# Altium schematic sheet ADC.SchDoc
size A
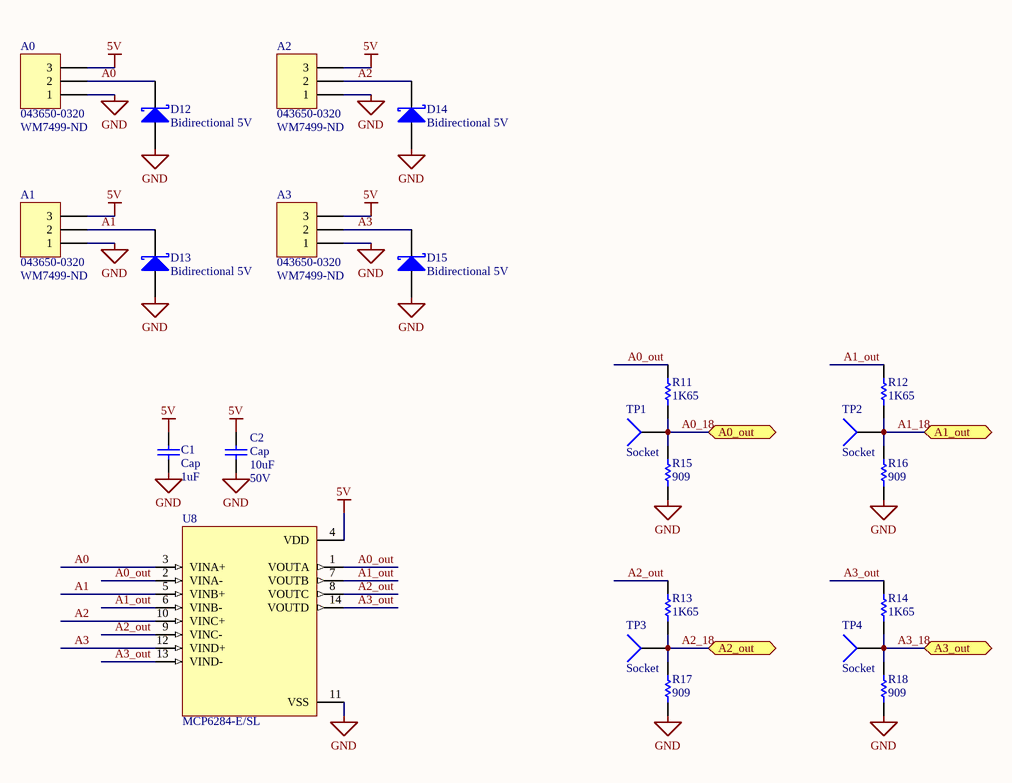
[diagram p0: ADC.SchDoc]

## Parts
A0  043650-0320  Vendor Part Number: WM7499-ND  [43650-0320]
A1  043650-0320  Vendor Part Number: WM7499-ND  [43650-0320]
A2  043650-0320  Vendor Part Number: WM7499-ND  [43650-0320]
A3  043650-0320  Vendor Part Number: WM7499-ND  [43650-0320]
C1  Cap  value 1uF  [RESC3116X65N]
C2  Cap  value 10uF  Voltage Rating: 50V  [CAPC3216X180N]
D12  Bidirectional 5V  [THRMC0603X33N]
D13  Bidirectional 5V  [THRMC0603X33N]
D14  Bidirectional 5V  [THRMC0603X33N]
D15  Bidirectional 5V  [THRMC0603X33N]
R11  value 1K65  [0402]  (hidden comment: Res1)
R12  value 1K65  [0402]  (hidden comment: Res1)
R13  value 1K65  [0402]  (hidden comment: Res1)
R14  value 1K65  [0402]  (hidden comment: Res1)
R15  value 909  [0402]  (hidden comment: Res1)
R16  value 909  [0402]  (hidden comment: Res1)
R17  value 909  [0402]  (hidden comment: Res1)
R18  value 909  [0402]  (hidden comment: Res1)
TP1  Socket  [5006]
TP2  Socket  [5006]
TP3  Socket  [5006]
TP4  Socket  [5006]
U8  MCP6284-E/SL  [SOIC127P600X175-14N]

## Ports
A0_out, A1_out, A2_out, A3_out

## Nets
5V: A0.3 A1.3 A2.3 A3.3 C1.2 C2.2 U8.4(VDD)
GND: A0.1 A1.1 A2.1 A3.1 C1.1 C2.1 D12.3(A) D13.3(A) D14.3(A) D15.3(A) R15.1 R16.1 R17.1 R18.1 U8.11(VSS)
A0: A0.2 D12.1(K) U8.3(VINA+)
A0_18: R11.1 R15.2 TP1.1 ; port A0_out
A0_out: R11.2 U8.1(VOUTA) U8.2(VINA-)
A1: A1.2 D13.1(K) U8.5(VINB+)
A1_18: R12.1 R16.2 TP2.1 ; port A1_out
A1_out: R12.2 U8.6(VINB-) U8.7(VOUTB)
A2: A2.2 D14.1(K) U8.10(VINC+)
A2_18: R13.1 R17.2 TP3.1 ; port A2_out
A2_out: R13.2 U8.8(VOUTC) U8.9(VINC-)
A3: A3.2 D15.1(K) U8.12(VIND+)
A3_18: R14.1 R18.2 TP4.1 ; port A3_out
A3_out: R14.2 U8.13(VIND-) U8.14(VOUTD)

## Library data of the parts
A0-A3 = Header 3: Header, 3-Pin; LatestRevisionDate: 17-Jul-2002; LatestRevisionNote: Re-released for DXP Platform.; Publisher: Altium Limited
C1 = Cap: Capacitor; Manufacturer Part Number: CL31B105KCHNNNE; Vendor Part Number: 1276-1838-1-ND
C2 = Cap: Capacitor; Manufacturer Part Number: CL31A106MBHNNNE; Vendor Part Number: 1276-6736-1-ND
D12-D15 = Diode 10TQ040: TVS; Manufacturer Part Number: CPDUC5V0R-HF; Vendor Part Number: 641-1764-1-ND
R11 = Res1: Resistor; Manufacturer Part Number: YAG3043CT-ND; Vendor Part Number: RC0402FR-071K65L; Tolerance: 1%
R12-R14 = Res1: Resistor; Manufacturer Part Number: RC0402FR-071K65L; Vendor Part Number: YAG3043CT-ND; Tolerance: 1%
R15-R18 = Res1: Resistor; Manufacturer Part Number: RC0402FR-071K8L; Vendor Part Number: YAG3256CT-ND; Tolerance: 1%
TP1-TP4 = Socket: Vendor Part Number: 36-5006-ND; LatestRevisionDate: 17-Jul-2002; LatestRevisionNote: Re-released for DXP Platform.; Publisher: Altium Limited; Manufacturer Part Number: 5006
U8 = MCP6284-E/SL: General Purpose Amplifier 4 Circuit Rail-to-Rail 14-SOIC; Vendor Part Number: MCP6284-E/SL-ND; MF: Microchip; Value: *; SnapEDA_Link: https://www.snapeda.com/parts/MCP6284-E/SL/Microchip/view-part/282490/?ref=snap; MP: MCP6284-E/SL; Availability: Warning; Mouser-Purchase-URL: https://snapeda.com/shop?store=Mouser&id=282490; Price: None; DigiKey-Purchase-URL: https://snapeda.com/shop?store=DigiKey&id=282490; Package: SOIC-14 Microchip; Manufacturer Part Number: MCP6284-E/SL